# EAGLE schematic PCB-Neopixel Developer (EAGLE 9.6.2)
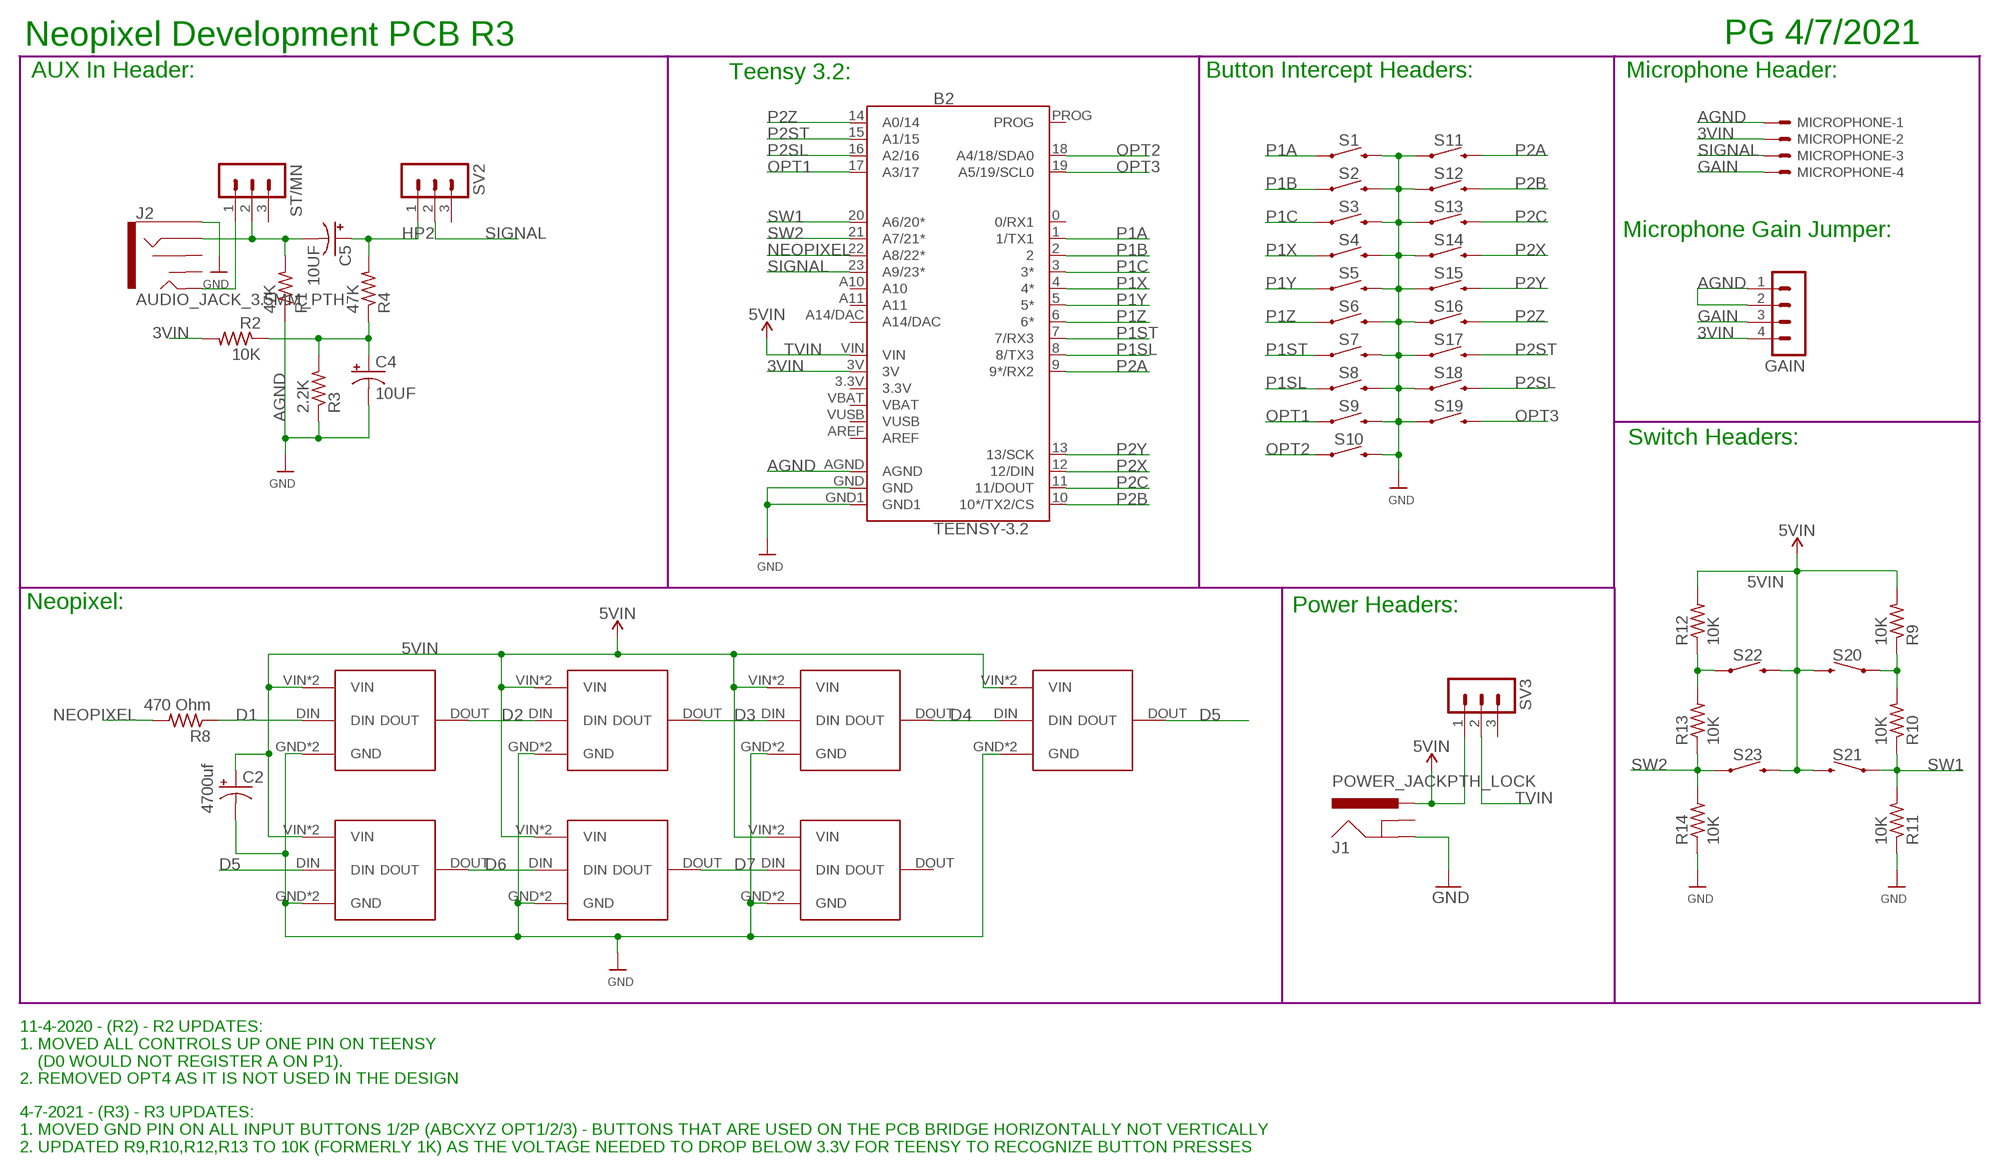
[diagram p0: schematic, sheet 1]

## Parts
B2  TEENSY-3.2  TEENSY-3.1SILK  [TEENSY-3.1]
C2  4700uf  CPOL-USE5-13  [E5-13]
C4  10UF  CPOL-USE5-8.5  [E5-8,5]
C5  10UF  CPOL-USE5-8.5  [E5-8,5]
GAIN  MA04-1  [MA04-1]
J1  POWER_JACKPTH_LOCK  [POWER_JACK_PTH_LOCK]
J2  AUDIO_JACK_3.5MM_PTH  [AUDIO-JACK]
MICROPHONE  KK-156-4  [KK-156-4]
R1  47K  R-US_R1206  [R1206]
R2  10K  R-US_R1206  [R1206]
R3  2.2K  R-US_R1206  [R1206]
R4  47K  R-US_R1206  [R1206]
R8  470 Ohm  R-US_R1206  [R1206]
R9  10K  R-US_R1206  [R1206]
R10  10K  R-US_R1206  [R1206]
R11  10K  R-US_R1206  [R1206]
R12  10K  R-US_R1206  [R1206]
R13  10K  R-US_R1206  [R1206]
R14  10K  R-US_R1206  [R1206]
S1  MOMENTARY-SWITCH-SPST-SMD-6.2MM-TALL  [TACTILE_SWITCH_SMD_6.2MM_TALL]
S2  MOMENTARY-SWITCH-SPST-SMD-6.2MM-TALL  [TACTILE_SWITCH_SMD_6.2MM_TALL]
S3  MOMENTARY-SWITCH-SPST-SMD-6.2MM-TALL  [TACTILE_SWITCH_SMD_6.2MM_TALL]
S4  MOMENTARY-SWITCH-SPST-SMD-6.2MM-TALL  [TACTILE_SWITCH_SMD_6.2MM_TALL]
S5  MOMENTARY-SWITCH-SPST-SMD-6.2MM-TALL  [TACTILE_SWITCH_SMD_6.2MM_TALL]
S6  MOMENTARY-SWITCH-SPST-SMD-6.2MM-TALL  [TACTILE_SWITCH_SMD_6.2MM_TALL]
S7  MOMENTARY-SWITCH-SPST-SMD-6.2MM-TALL  [TACTILE_SWITCH_SMD_6.2MM_TALL]
S8  MOMENTARY-SWITCH-SPST-SMD-6.2MM-TALL  [TACTILE_SWITCH_SMD_6.2MM_TALL]
S9  MOMENTARY-SWITCH-SPST-SMD-6.2MM-TALL  [TACTILE_SWITCH_SMD_6.2MM_TALL]
S10  MOMENTARY-SWITCH-SPST-SMD-6.2MM-TALL  [TACTILE_SWITCH_SMD_6.2MM_TALL]
S11  MOMENTARY-SWITCH-SPST-SMD-6.2MM-TALL  [TACTILE_SWITCH_SMD_6.2MM_TALL]
S12  MOMENTARY-SWITCH-SPST-SMD-6.2MM-TALL  [TACTILE_SWITCH_SMD_6.2MM_TALL]
S13  MOMENTARY-SWITCH-SPST-SMD-6.2MM-TALL  [TACTILE_SWITCH_SMD_6.2MM_TALL]
S14  MOMENTARY-SWITCH-SPST-SMD-6.2MM-TALL  [TACTILE_SWITCH_SMD_6.2MM_TALL]
S15  MOMENTARY-SWITCH-SPST-SMD-6.2MM-TALL  [TACTILE_SWITCH_SMD_6.2MM_TALL]
S16  MOMENTARY-SWITCH-SPST-SMD-6.2MM-TALL  [TACTILE_SWITCH_SMD_6.2MM_TALL]
S17  MOMENTARY-SWITCH-SPST-SMD-6.2MM-TALL  [TACTILE_SWITCH_SMD_6.2MM_TALL]
S18  MOMENTARY-SWITCH-SPST-SMD-6.2MM-TALL  [TACTILE_SWITCH_SMD_6.2MM_TALL]
S19  MOMENTARY-SWITCH-SPST-SMD-6.2MM-TALL  [TACTILE_SWITCH_SMD_6.2MM_TALL]
S20  MOMENTARY-SWITCH-SPST-PTH-6.0MM  [TACTILE_SWITCH_PTH_6.0MM]
S21  MOMENTARY-SWITCH-SPST-PTH-6.0MM  [TACTILE_SWITCH_PTH_6.0MM]
S22  MOMENTARY-SWITCH-SPST-PTH-6.0MM  [TACTILE_SWITCH_PTH_6.0MM]
S23  MOMENTARY-SWITCH-SPST-PTH-6.0MM  [TACTILE_SWITCH_PTH_6.0MM]
ST/MN  MA03-1  [MA03-1]
SV2  MA03-1  [MA03-1]
SV3  MA03-1  [MA03-1]
U$2  NP-2  [NP-2]
U$7  NP-2  [NP-2]
U$8  NP-3  [NP-3]
U$10  NP-3  [NP-3]
U$11  NP-3  [NP-3]
U$12  NP-3  [NP-3]
U$13  NP-3  [NP-3]

## Nets
3VIN: B2.3V GAIN.4 MICROPHONE.2 R2.2
5VIN: C2.+ J1.PWR R9.2 R12.2 S20.3 S21.3 S22.3 S23.3 SV3.1 U$2.VIN U$2.VOUT(VIN) U$7.VIN U$7.VOUT(VIN) U$8.VIN U$8.VOUT(VIN) U$10.VIN U$10.VOUT(VIN) U$11.VIN U$11.VOUT(VIN) U$12.VIN U$12.VOUT(VIN) U$13.VIN U$13.VOUT(VIN)
AGND: B2.AGND C4.- GAIN.1 GAIN.2 J2.SLEEVE MICROPHONE.1 R1.1 R3.1 ; supply symbol labelled GND
D1: R8.1 U$12.DIN
D2: U$12.DOUT U$13.DIN
D3: U$2.DIN U$13.DOUT
D4: U$2.DOUT U$11.DIN
D5: U$7.DIN U$11.DOUT
D6: U$7.DOUT U$8.DIN
D7: U$8.DOUT U$10.DIN
GAIN: GAIN.3 MICROPHONE.4
GND: B2.GND B2.GND1 C2.- J1.GND R11.1 R14.1 S1.A1 S2.A1 S3.A1 S4.A1 S5.A1 S6.A1 S7.A1 S8.A1 S9.A1 S10.A1 S11.A2 S12.A2 S13.A2 S14.A2 S15.A2 S16.A2 S17.A2 S18.A2 S19.A2 U$2.GND U$2.GND1(GND) U$7.GND U$7.GND1(GND) U$8.GND U$8.GND1(GND) U$10.GND U$10.GND1(GND) U$11.GND U$11.GND1(GND) U$12.GND U$12.GND1(GND) U$13.GND U$13.GND1(GND)
HP1: C4.+ R2.1 R3.2 R4.1
HP2: C5.+ R4.2 SV2.1
N$2: J2.TIP ST/MN.1
N$4: C5.- J2.RING R1.2 ST/MN.2
NEOPIXEL: B2.22(A8/22*) R8.2
OPT1: B2.17(A3/17) S9.A2
OPT2: B2.18(A4/18/SDA0) S10.A2
OPT3: B2.19(A5/19/SCL0) S19.A1
P1A: B2.1(1/TX1) S1.A2
P1B: B2.2 S2.A2
P1C: B2.3(3*) S3.A2
P1SL: B2.8(8/TX3) S8.A2
P1ST: B2.7(7/RX3) S7.A2
P1X: B2.4(4*) S4.A2
P1Y: B2.5(5*) S5.A2
P1Z: B2.6(6*) S6.A2
P2A: B2.9(9*/RX2) S11.A1
P2B: B2.10(10*/TX2/CS) S12.A1
P2C: B2.11(11/DOUT) S13.A1
P2SL: B2.16(A2/16) S18.A1
P2ST: B2.15(A1/15) S17.A1
P2X: B2.12(12/DIN) S14.A1
P2Y: B2.13(13/SCK) S15.A1
P2Z: B2.14(A0/14) S16.A1
SIGNAL: B2.23(A9/23*) MICROPHONE.3 SV2.2
SW1: B2.20(A6/20*) R10.1 R11.2 S21.1
SW1A: R9.1 R10.2 S20.1
SW2: B2.21(A7/21*) R13.1 R14.2 S23.1
SW2A: R12.1 R13.2 S22.1
TVIN: B2.VIN SV3.2 ; supply symbol labelled 5VIN
Unconnected: B2.0(0/RX1) B2.A10 B2.A11 B2.A14/DAC B2.AREF B2.PROG J1.GNDBREAK J2.RSH J2.TSH ST/MN.3 SV2.3 SV3.3 U$10.DOUT

## Notes on the sheet
- Neopixel Development PCB R3 | PG 4/7/2021
- AUX In Header: | Teensy 3.2: | Button Intercept Headers: | Microphone Header:
- Microphone Gain Jumper:
- Switch Headers:
- Neopixel: | Power Headers:
- 11-4-2020 - (R2) - R2 UPDATES:
  1. MOVED ALL CONTROLS UP ONE PIN ON TEENSY
      (D0 WOULD NOT REGISTER A ON P1).
  2. REMOVED OPT4 AS IT IS NOT USED IN THE DESIGN
- 4-7-2021 - (R3) - R3 UPDATES:
  1. MOVED GND PIN ON ALL INPUT BUTTONS 1/2P (ABCXYZ OPT1/2/3) - BUTTONS THAT ARE USED ON THE PCB BRIDGE HORIZONTALLY NOT VERTICALLY
  2. UPDATED R9,R10,R12,R13 TO 10K (FORMERLY 1K) AS THE VOLTAGE NEEDED TO DROP BELOW 3.3V FOR TEENSY TO RECOGNIZE BUTTON PRESSES

## Power pins joined to a net without a drawn wire
3.3V: B2.3.3V
VBAT: B2.VBAT
VUSB: B2.VUSB

## Library data of the parts
B2 = SparkFun-Boards:TEENSY-3.1: Teensy 3+ Footprint Mechanical footprint with connectors for Teensy Development Board with ARM Cortex. SparkFun Products: Teensy 3.2 <https://www.sparkfun.com/products/13736> Teensy LC <https://www.sparkfun.com/products/13305>; SF_ID: DEV-12646
C2 C4 C5 = adafruit:CPOL-US: POLARIZED CAPACITOR, American symbol
GAIN = con-lstb:MA04-1: PIN HEADER; OC_FARNELL: unknown; OC_NEWARK: unknown
J1 = SparkFun-Connectors:POWER_JACK: Power Jack Connector This is the standard 5.5mm barrel jack for power. The PTH is the most common, proven, reliable, footprint. The Slot footprint only works if the mill layer is transmitted to the PCB fab house so be warned. Here are the connectors we sell at SparkFun: DC Barrel Power Jack/Connector <https://www.sparkfun.com/products/119> (PRT-00119) DC Barrel Power Jack/Connector (SMD) <https://www.sparkfun.com/products/12748> (PRT-12748) DC Barrel Jack Adapter - Breadboard Compatible <https://www.sparkfun.com/products/10811> (PRT-10811) It is used on this SparkFun product (and many, many others): SparkFun RedBoard - Programmed with Arduino <https://www.sparkfun.com/products/12757> (DEV-12757) Also, if you need a mating power supply or connector, please check these out: Wall Adapter Power Supply - 9VDC 650mA <https://www.sparkfun.com/products/298> (TOL-00298) DC Barrel Jack Adapter - Male <https://www.sparkfun.com/products/10287> (PRT-10287); PROD_ID: CONN-08197; SF_ID: PRT-00119
J2 = SparkFun-Connectors:AUDIO_JACK_3.5MM: Audio Jack 3.5mm variants of PTH and SMT stereo audio jack with bypass switches. SparkFun Products: SparkFun SparkPunk Sound Kit <[https://www.sparkfun.com/products/11177]> - PTH MP3 Trigger <https://www.sparkfun.com/products/13720> -3.5mm SMD SparkFun PicoBoard <https://www.sparkfun.com/products/11888>- 2.5mm SMD; PROD_ID: CONN-08774; SF_ID: PRT-08032
MICROPHONE = con-molex:KK-156-4: KK 156 HEADER Source: http://www.molex.com/pdm_docs/sd/026604100_sd.pdf; MF: MOLEX; OC_FARNELL: unknown; OC_NEWARK: unknown
R1-R4 R8-R14 = adafruit:R-US_: RESISTOR, American symbol
S1-S19 = SparkFun-Switches - Mod for NP DevPCB:MOMENTARY-SWITCH-SPST: Momentary Switch (Pushbutton) - SPST Normally-open (NO) SPST momentary switches (buttons, pushbuttons). Variants PTH-12MM - 12mm square, through-hole Momentary Pushbutton Switch - 12mm Square <https://www.sparkfun.com/products/9190> (COM-09190) PTH-6.0MM, PTH-6.0MM-KIT - 6.0mm square, through-hole Mini Pushbutton Switch <https://www.sparkfun.com/products/97> (COM-00097) KIT package intended for soldering kit's - only one side of pads' copper is exposed. PTH-RIGHT-ANGLE-KIT - Right-angle, through-hole Right Angle Tactile Button <https://www.sparkfun.com/products/10791> - Used on SparkFun BigTime Watch Kit <https://www.sparkfun.com/products/11734> SMD-12MM - 12mm square, surface-mount Tactile Button - SMD (12mm) <https://www.sparkfun.com/products/12993> (COM-12993) Used on SparkFun PicoBoard <https://www.sparkfun.com/products/11888> SMD-4.5MM - 4.5mm Square Trackball Switch Used on SparkFun Blackberry Trackballer Breakout <https://www.sparkfun.com/products/13169> SMD-4.6MMX2.8MM - 4.60mm x 2.80mm, surface mount Used on SparkFun SAMD21 Mini Breakout <https://www.sparkfun.com/products/13664> SMD-5.2MM, SMD-5.2-REDUNDANT - 5.2mm square, surface-mount Mini Pushbutton Switch - SMD <https://www.sparkfun.com/products/8720> (COM-08720) Used on Arduino Pro Mini <https://www.sparkfun.com/products/11114> REDUNDANT package connects both switch circuits together SMD-6.0X3.5MM - 6.0 x 3.5mm, surface mount Momentary Reset Switch SMD <https://www.sparkfun.com/products/8229> (COM-08229) SMD-6.2MM-TALL - 6.2mm square, surface mount Tactile Button - SMD (6mm) <https://www.sparkfun.com/products/12992> Used on SparkFun Digital Sandbox <https://www.sparkfun.com/products/12651> SMD-RIGHT-ANGLE - Right-angle, surface mount Used on SparkFun Block for Intel® Edison - Arduino <https://www.sparkfun.com/products/13036>; PROD_ID: SWCH-11966; SF_SKU: COM-12992
S20-S23 = SparkFun-Switches:MOMENTARY-SWITCH-SPST: Momentary Switch (Pushbutton) - SPST Normally-open (NO) SPST momentary switches (buttons, pushbuttons). Variants PTH-12MM - 12mm square, through-hole Momentary Pushbutton Switch - 12mm Square <https://www.sparkfun.com/products/9190> (COM-09190) PTH-6.0MM, PTH-6.0MM-KIT - 6.0mm square, through-hole Mini Pushbutton Switch <https://www.sparkfun.com/products/97> (COM-00097) KIT package intended for soldering kit's - only one side of pads' copper is exposed. PTH-RIGHT-ANGLE-KIT - Right-angle, through-hole Right Angle Tactile Button <https://www.sparkfun.com/products/10791> - Used on SparkFun BigTime Watch Kit <https://www.sparkfun.com/products/11734> SMD-12MM - 12mm square, surface-mount Tactile Button - SMD (12mm) <https://www.sparkfun.com/products/12993> (COM-12993) Used on SparkFun PicoBoard <https://www.sparkfun.com/products/11888> SMD-4.5MM - 4.5mm Square Trackball Switch Used on SparkFun Blackberry Trackballer Breakout <https://www.sparkfun.com/products/13169> SMD-4.6MMX2.8MM - 4.60mm x 2.80mm, surface mount Used on SparkFun SAMD21 Mini Breakout <https://www.sparkfun.com/products/13664> SMD-5.2MM, SMD-5.2-REDUNDANT - 5.2mm square, surface-mount Mini Pushbutton Switch - SMD <https://www.sparkfun.com/products/8720> (COM-08720) Used on Arduino Pro Mini <https://www.sparkfun.com/products/11114> REDUNDANT package connects both switch circuits together SMD-6.0X3.5MM - 6.0 x 3.5mm, surface mount Momentary Reset Switch SMD <https://www.sparkfun.com/products/8229> (COM-08229) SMD-6.2MM-TALL - 6.2mm square, surface mount Tactile Button - SMD (6mm) <https://www.sparkfun.com/products/12992> Used on SparkFun Digital Sandbox <https://www.sparkfun.com/products/12651> SMD-RIGHT-ANGLE - Right-angle, surface mount Used on SparkFun Block for Intel® Edison - Arduino <https://www.sparkfun.com/products/13036>; PROD_ID: SWCH-08441; SF_SKU: COM-00097
ST/MN SV2 SV3 = con-lstb:MA03-1: PIN HEADER; OC_FARNELL: unknown; OC_NEWARK: unknown
U$2 U$7 = Neopixel:NP-2
U$8 U$10-U$13 = Neopixel:NP-3